# Altium schematic sheet esp.SchDoc (part 2 of 3)
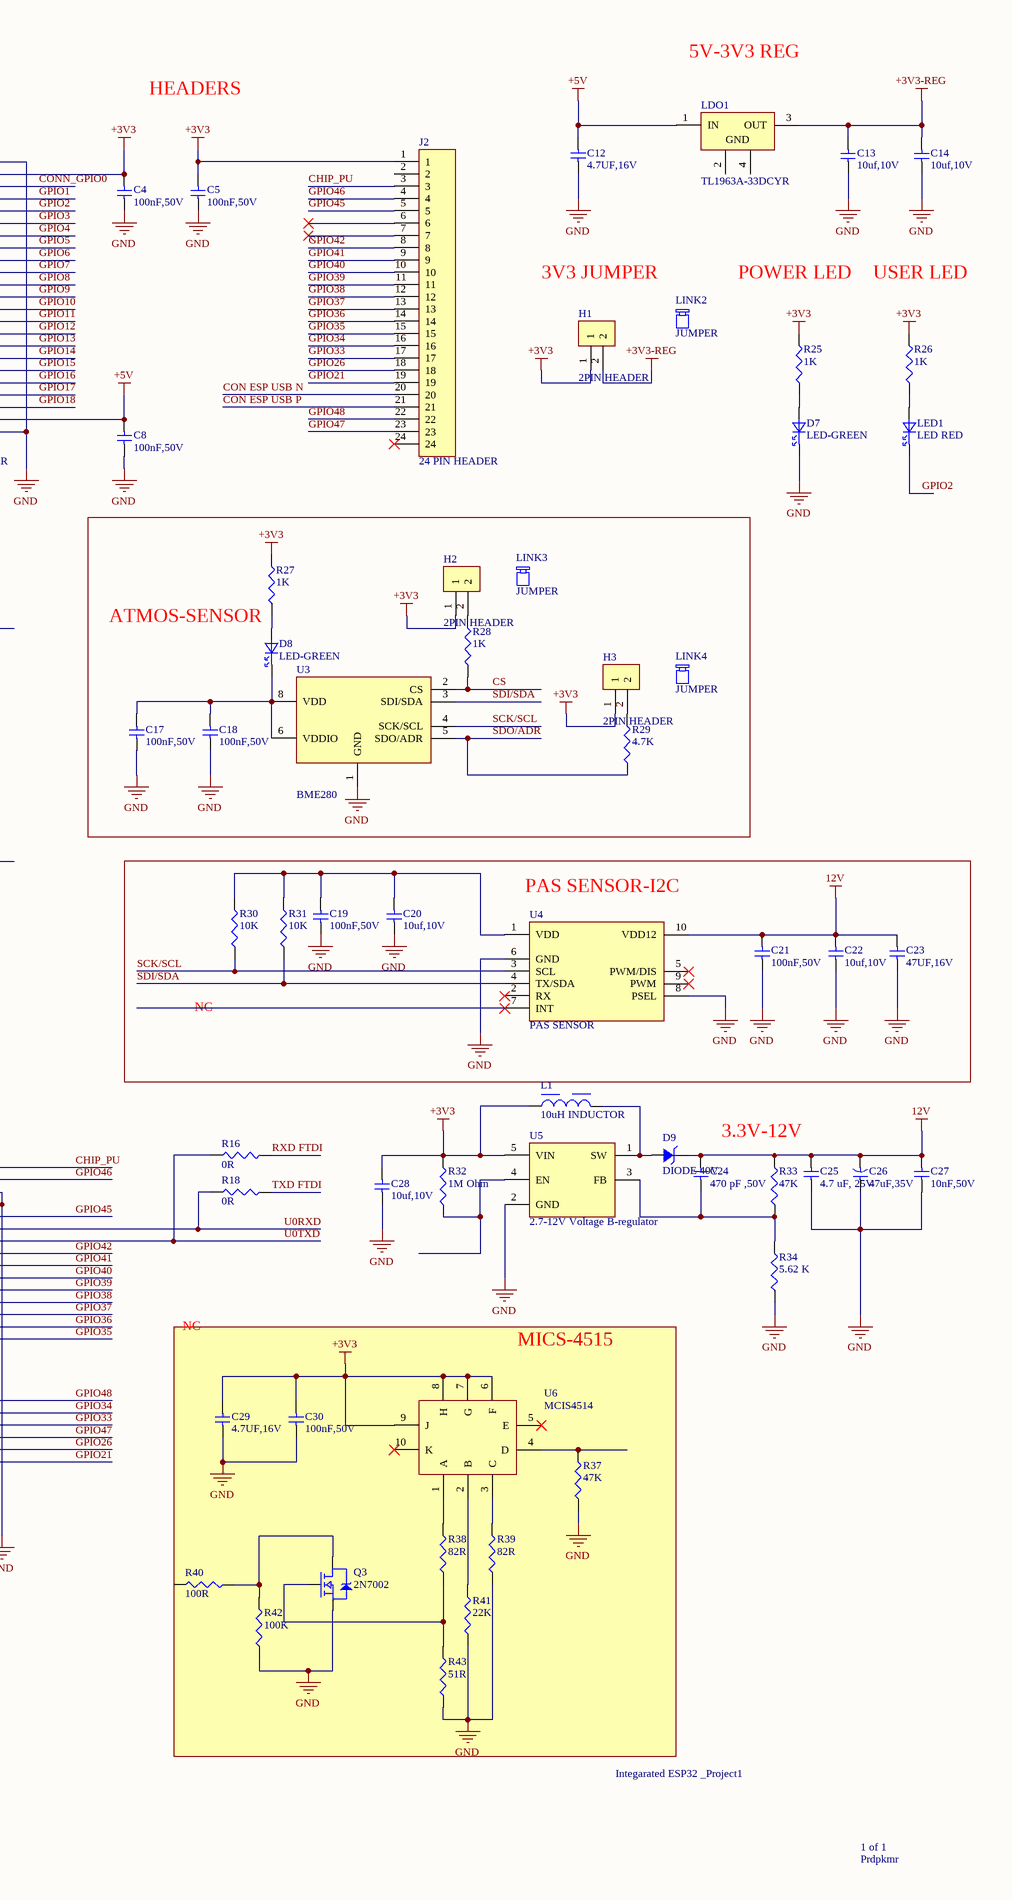
[diagram p2: esp.SchDoc, right]
## Library data of the parts
C1 C12 C29 = CL05A475KQ5NRNC: CAP CER 4.7UF 6.3V X5R 0402; Manufacturer: Samsung; Material: Ceramic; Tolerance: 10%; Supplier: Avnet; Supplier Part Number: CL05A475KQ5NRNC; Manufacturer Part Number: CL05A475KQ5NRNC; RoHS: Yes; Category: Ceramic Capacitors; Stock: 1403600; Pricing: 1=0.00646 (USD); Mounting Technology: Surface Mount; Case/Package: 0402; Case Code (Metric): 1005; Case Code (Imperial): 0402; Min Operating Temperature: -55°C; Max Operating Temperature: 85°C; Package Quantity: 1; Packaging: Tape and Reel; Value: 4.7uF; Voltage Rating: 6.3V; Dielectric: X5R; Series: CL; Construction: Flat; Length: 1mm; Width: 0.02inch; Height: 0.5mm; Thickness: 0.022inch; Depth: 0.5mm; Radiation Hardening: No; Lead Free: Lead Free; RoHS Compliant: Yes; ComponentLink1URL: https://datasheet.ciiva.com/25793/cl05a475kq5nrnc-25793634.pdf?src-supplier=Digikey; ComponentLink1Description: https://datasheet.ciiva.com/25793/cl05a475kq5nrnc-25793634.pdf?src-supplier=Digikey; ComponentLink2URL: https://datasheet.ciiva.com/26838/getdatasheetpartid-353228-26838196.pdf?src-supplier=Verical; ComponentLink2Description: https://datasheet.ciiva.com/26838/getdatasheetpartid-353228-26838196.pdf?src-supplier=Verical; LCSC PART Number: C2932473
C2-C10 C16-C19 C21 C30 = CL05B104KB54PNC: Manufacturer: Samsung; Material: 4241ConductorMaterial; Tolerance: 10%; Supplier: Avnet; Supplier Part Number: CL05B104KB54PNC; Manufacturer Part Number: CL05B104KB54PNC; RoHS: Yes; Category: Ceramic Capacitors; Pricing: 10000=0.00428, 20000=0.00423, 40000=0.00747, 60000=0.00411, 80000=0.00406 (USD); Min Operating Temperature: -55°C; Max Operating Temperature: 125°C; Value: 100nF; Voltage Rating: 50V; Height: 550um; RoHS Compliant: Yes; ComponentLink1URL: https://datasheet.octopart.com/CL05B104KB54PNC-Samsung-datasheet-8326407.pdf?src-supplier=TME; ComponentLink1Description: https://datasheet.octopart.com/CL05B104KB54PNC-Samsung-datasheet-8326407.pdf?src-supplier=TME; LCSC PART Number: C307331
C11 C13 C14 C20 C22 C28 = CL05A106MP5NRNC: Manufacturer: Samsung; Material: Ceramic; Tolerance: 20%; Supplier: Avnet; Supplier Part Number: CL05A106MP5NRNC; Manufacturer Part Number: CL05A106MP5NRNC; RoHS: Yes; Category: Ceramic Capacitors; Pricing: 100000=0.0442, 120000=0.04397, 220000=0.04375, 500000=0.04352, 1000000=0.0433 (USD); Case/Package: 0402; Min Operating Temperature: -55°C; Max Operating Temperature: 85°C; Value: 10uF; Voltage Rating: 10V; Height: 550um; RoHS Compliant: Yes; LCSC PART Number: C315248
C15 = CL05A105KL5NRNC: Manufacturer: Samsung; Material: 4241ConductorMaterial; Voltage Rating: 35V; Tolerance: 10%; Supplier: Digikey; Supplier Part Number: 1276-6796-1-ND; Manufacturer Part Number: CL05A105KL5NRNC; RoHS: Yes; Category: Ceramic Capacitors; Stock: 194971; Pricing: 1=0.27, 10=0.17, 100=0.1027, 1000=0.07807, 2500=0.06853, 5000=0.0679, 10000=0.05902, 20000=0.05548, 30000=0.05372, 50000=0.05194, 70000=0.04872, 100000=0.04608 (USD); Mounting Technology: Surface Mount; Case/Package: 0402; Case Code (Metric): 1005; Case Code (Imperial): 0402; Min Operating Temperature: -55°C; Max Operating Temperature: 85°C; Packaging: Cut Tape; Value: 1uF; Series: CL; Length: 0.039inch; Width: 0.02inch; Height: 550um; Thickness: 0.022inch; RoHS Compliant: Yes; ComponentLink1URL: http://www.samsungsem.com/kr/support/product-search/mlcc/CL05A105KL5NRNC.jsp?src-supplier=Digikey; ComponentLink1Description: http://www.samsungsem.com/kr/support/product-search/mlcc/CL05A105KL5NRNC.jsp?src-supplier=Digikey; ComponentLink2URL: https://datasheet.octopart.com/CL05A105KL5NRNC-Samsung-datasheet-8326407.pdf?src-supplier=TME; ComponentLink2Description: https://datasheet.octopart.com/CL05A105KL5NRNC-Samsung-datasheet-8326407.pdf?src-supplier=TME; LCSC PART Number: C307413
C23 = T499D476K016ATE800: CAP TANT 47UF 10% 16V 2917; Manufacturer: KEMET; Dielectric Material: Tantalum; ESR (Equivalent Series Resistance): 800mR; Polarity: Polar; Dissipation Factor: 6%; Supplier: Mouser; Supplier Part Number: 80-T499D476K16TE800; Manufacturer Part Number: T499D476K016ATE800; RoHS: Yes; Category: Tantalum Capacitors; Stock: 4898; Pricing: 1=2.24, 10=1.43, 50=1.31, 100=1.31, 1000=1.12, 10000=0.758 (USD); Mounting Technology: Surface Mount; Case/Package: 2917; Pins: 2; Case Code (Metric): 7343; Case Code (Imperial): 2917; Min Operating Temperature: -55°C; Max Operating Temperature: 175°C; Package Quantity: 1; Value: 47uF; Voltage Rating: 16V; Tolerance: 10%; Packaging: Tape and Reel; Voltage Rating (DC): 16V; Termination: SMD/SMT; Features: General Purpose; Series: T499; Construction: Flat; Length: 7.3mm; Width: 0.169inch; Height: 3.1mm; Height - Seated (Max): 0.11inch; Depth: 4.3mm; Ratings: AEC-Q200; Radiation Hardening: No; Reach SVHC Compliant: No; Lead Free: Lead Free; RoHS Compliant: Yes; ComponentLink1URL: https://datasheet.ciiva.com/261/kem-t2054-t499-auto-261119.pdf?src-supplier=Digikey; ComponentLink1Description: https://datasheet.ciiva.com/261/kem-t2054-t499-auto-261119.pdf?src-supplier=Digikey; ComponentLink2URL: https://datasheet.ciiva.com/261/kem-t2054-t499-auto-261120.pdf?src-supplier=Digikey; ComponentLink2Description: https://datasheet.ciiva.com/261/kem-t2054-t499-auto-261120.pdf?src-supplier=Digikey; ComponentLink3URL: https://datasheet.ciiva.com/261/kem-t2054-t499-auto-261121.pdf?src-supplier=Digikey; ComponentLink3Description: https://datasheet.ciiva.com/261/kem-t2054-t499-auto-261121.pdf?src-supplier=Digikey; LCSC PART Number: C122336
C24 = CC0402FRNPO9BN471: CAP CER 470PF 50V C0G/NPO 0402; Manufacturer: Yageo; Supplier: Future Electronics; Supplier Part Number: 5114427; Manufacturer Part Number: CC0402FRNPO9BN471; RoHS: Yes; Category: Ceramic Capacitors; Stock: 10000; Pricing: 10000=0.015, 20000=0.0148, 30000=0.0146, 50000=0.0145, 100000=0.0141 (USD); RoHS Compliant: Yes; ComponentLink1URL: https://datasheet.octopart.com/CC0402FRNPO9BN471-Yageo-datasheet-151948684.pdf?src-supplier=Farnell; ComponentLink1Description: https://datasheet.octopart.com/CC0402FRNPO9BN471-Yageo-datasheet-151948684.pdf?src-supplier=Farnell; ComponentLink2URL: https://datasheet.octopart.com/CC0402FRNPO9BN471-Yageo-datasheet-151948684.pdf?src-supplier=Newark; ComponentLink2Description: https://datasheet.octopart.com/CC0402FRNPO9BN471-Yageo-datasheet-151948684.pdf?src-supplier=Newark; ComponentLink3URL: https://datasheet.octopart.com/CC0402FRNPO9BN471-Yageo-datasheet-137875056.pdf?src-supplier=Future+Electronics; ComponentLink3Description: https://datasheet.octopart.com/CC0402FRNPO9BN471-Yageo-datasheet-137875056.pdf?src-supplier=Future+Electronics; LCSC PART Number: C513551
C25 = KGM05CR51E475MH: Cap Cer 4.7UF 25V X5R 0402; Manufacturer: Kyocera AVX; Supplier: Digikey; Supplier Part Number: 478-KGM05CR51E475MHCT-ND; Manufacturer Part Number: KGM05CR51E475MH; RoHS: No; Stock: 57965; Pricing: 1=0.26, 10=0.167, 100=0.1145, 1000=0.08368, 2500=0.07509, 5000=0.0696 (USD); LCSC PART Number: C20218024
C26 = T495X476M035ATE300: CAP TANT 47UF 20% 35V 2917; Manufacturer: KEMET; Dielectric Material: 5684ConductorMaterial; ESR (Equivalent Series Resistance): 300mR; Dissipation Factor: 8%; Supplier: Arrow Electronics; Supplier Part Number: T495X476M035ATE300; Manufacturer Part Number: T495X476M035ATE300; RoHS: Yes; Category: Tantalum Capacitors; Stock: 1000; Pricing: 500=1.0041, 1000=0.9091, 2000=0.8325, 5000=0.8058, 10000=0.7684 (USD); Mounting Technology: Surface Mount; Case/Package: 2917; Pins: 2; Case Code (Metric): 7343; Case Code (Imperial): 2917; Weight: 0.023634oz; Min Operating Temperature: -55°C; Max Operating Temperature: 125°C; Packaging: Tape and Reel; Value: 47uF; Voltage Rating: 35V; Tolerance: 20%; Voltage Rating (DC): 35V; Termination: SMD/SMT; Features: General Purpose; Series: T495; Construction: Flat; Length: 7.3mm; Width: 4.3mm; Height: 4.3mm; Depth: 4.3mm; Radiation Hardening: No; Reach SVHC Compliant: No; RoHS Compliant: Yes; ComponentLink1URL: https://datasheet.ciiva.com/5933/kem-t2009-t495-5933557.pdf?src-supplier=Farnell; ComponentLink1Description: https://datasheet.ciiva.com/5933/kem-t2009-t495-5933557.pdf?src-supplier=Farnell; ComponentLink2URL: https://datasheet.ciiva.com/46437/1761160-46437884.pdf?src-supplier=Element14; ComponentLink2Description: https://datasheet.ciiva.com/46437/1761160-46437884.pdf?src-supplier=Element14; ComponentLink3URL: https://datasheet.ciiva.com/7759/kem-t2009-t495-7759181.pdf?src-supplier=Element14; ComponentLink3Description: https://datasheet.ciiva.com/7759/kem-t2009-t495-7759181.pdf?src-supplier=Element14; LCSC PART Number: C4984204
C27 = C0402C103K5RECAUTO: CAP CER 0402 10NF 50V X7R 10%; Manufacturer: KEMET; Supplier: Arrow Electronics; Supplier Part Number: C0402C103K5RECAUTO; Manufacturer Part Number: C0402C103K5RECAUTO; RoHS: Yes; Category: Ceramic Capacitors; Stock: 2267; Pricing: 1=0.078, 10=0.058, 25=0.054, 100=0.0297, 250=0.0294, 500=0.0291, 1000=0.0175 (USD); Mounting Technology: Surface Mount; Case/Package: 0402; Min Operating Temperature: -55°C; Max Operating Temperature: 125°C; Packaging: Tape and Reel; Value: 10nF; Tolerance: 10%; Voltage Rating: 50V; Series: ESD SMD Auto X7R; Dielectric: X7R; Voltage Rating (DC): 50V; Ratings: AEC-Q200; RoHS Compliant: Yes; ComponentLink1URL: https://datasheet.octopart.com/C0402C103K5RECAUTO-KEMET-datasheet-149521617.pdf?src-supplier=Farnell; ComponentLink1Description: https://datasheet.octopart.com/C0402C103K5RECAUTO-KEMET-datasheet-149521617.pdf?src-supplier=Farnell; ComponentLink2URL: https://api.kemet.com/component-edge/download/datasheet/C0402C103K5RECAUTO.pdf?src-supplier=Digikey; ComponentLink2Description: https://api.kemet.com/component-edge/download/datasheet/C0402C103K5RECAUTO.pdf?src-supplier=Digikey; ComponentLink3URL: https://datasheet.octopart.com/C0402C103K5RECAUTO-KEMET-datasheet-175422754.pdf?src-supplier=Newark; ComponentLink3Description: https://datasheet.octopart.com/C0402C103K5RECAUTO-KEMET-datasheet-175422754.pdf?src-supplier=Newark; ComponentLink4URL: http://www.farnell.com/datasheets/2723677.pdf?src-supplier=Newark; ComponentLink4Description: http://www.farnell.com/datasheets/2723677.pdf?src-supplier=Newark; ComponentLink5URL: http://www.farnell.com/datasheets/2723677.pdf?src-supplier=Element14; ComponentLink5Description: http://www.farnell.com/datasheets/2723677.pdf?src-supplier=Element14; ComponentLink6URL: https://datasheet.octopart.com/C0402C103K5RECAUTO-KEMET-datasheet-153706760.pdf?src-supplier=Electro+Sonic; ComponentLink6Description: https://datasheet.octopart.com/C0402C103K5RECAUTO-KEMET-datasheet-153706760.pdf?src-supplier=Electro+Sonic; LCSC PART Number: C1513170
D1-D6 = AQ3045-01ETG: TVS DIODE 5.3VWM 12VC SOD882; Manufacturer: Littelfuse; Number of Bidirectional Channels: 1; Reverse Standoff Voltage: 5.3V; Min Breakdown Voltage: 6.8V; Peak Pulse Current: 3A; Peak Pulse Power: 40W; Power Line Protection: No; Diode Type: ZENER; Leakage Current: 100nA; Supplier: Digikey; Supplier Part Number: F9321CT-ND; Manufacturer Part Number: AQ3045-01ETG; RoHS: Yes; Category: TVS Diodes; Stock: 12123; Pricing: 1=0.46, 10=0.302, 100=0.141, 500=0.134, 1000=0.127, 2000=0.1255, 5000=0.124 (USD); Mounting Technology: Surface Mount; Min Operating Temperature: -55°C; Max Operating Temperature: 150°C; Packaging: Cut Tape; Series: Automotive, AEC-Q101, AQ3045, SPA®; Number of Channels: 1; Operating Supply Voltage: 5.3V; RoHS Compliant: Yes; ComponentLink1URL: http://www.littelfuse.com/~/media/electronics/datasheets/tvs_diode_arrays/littelfuse_tvs_diode_array_aq3045_datasheet.pdf.pdf?src-supplier=Digikey; ComponentLink1Description: http://www.littelfuse.com/~/media/electronics/datasheets/tvs_diode_arrays/littelfuse_tvs_diode_array_aq3045_datasheet.pdf.pdf?src-supplier=Digikey; ComponentLink2URL: https://www.littelfuse.com/~/media/electronics/datasheets/tvs_diode_arrays/littelfuse_tvs_diode_array_aq3045_datasheet.pdf.pdf?src-supplier=Digikey; ComponentLink2Description: https://www.littelfuse.com/~/media/electronics/datasheets/tvs_diode_arrays/littelfuse_tvs_diode_array_aq3045_datasheet.pdf.pdf?src-supplier=Digikey; ComponentLink3URL: https://datasheet.octopart.com/AQ3045-01ETG-Littelfuse-datasheet-101609968.pdf?src-supplier=Farnell; ComponentLink3Description: https://datasheet.octopart.com/AQ3045-01ETG-Littelfuse-datasheet-101609968.pdf?src-supplier=Farnell; ComponentLink4URL: https://datasheet.octopart.com/AQ3045-01ETG-Littelfuse-datasheet-140480283.pdf?src-supplier=Future+Electronics; ComponentLink4Description: https://datasheet.octopart.com/AQ3045-01ETG-Littelfuse-datasheet-140480283.pdf?src-supplier=Future+Electronics; LCSC PART Number: C3710326
D7 D8 = VLMG1500-GS08: LED YLW-GRN 0402 SMD; Manufacturer: Vishay; Color: Green,Yellow; Lens Color: Clear; Viewing Angle: 130°; Illumination Color: Green; Forward Current: 30mA; Forward Voltage: 2V; Luminous Intensity: 35mcd; Dominant Wavelength: 571nm; Test Current: 20mA; Number of Elements: 1; Power Dissipation: 75mW; Lens Style: Rectangular; Reverse Voltage: 5V; Supplier: Mouser; Supplier Part Number: 78-VLMG1500-GS08; Manufacturer Part Number: VLMG1500-GS08; RoHS: Yes; Category: LEDs; Stock: 31007; Pricing: 1=0.33, 10=0.189, 50=0.189, 100=0.089, 1000=0.08, 10000=0.055 (USD); Mounting Technology: Surface Mount; Case/Package: 0402; Pins: 2; Case Code (Metric): 1005; Case Code (Imperial): 0402; Min Operating Temperature: -30°C; Max Operating Temperature: 85°C; Package Quantity: 1; Packaging: Tape and Reel; Wavelength: 571nm; Number of LEDs: 1; Power Rating: 75mW; Series: CHipLED; Length: 1mm; Width: 0.5mm; Height: 0.35mm; Depth: 0.5mm; Radiation Hardening: No; Lead Free: Lead Free; RoHS Compliant: Yes; Reach SVHC Compliant: Unknown; ComponentLink1URL: https://datasheet.ciiva.com/13945/vlmo1500-13945360.pdf?src-supplier=Digikey; ComponentLink1Description: https://datasheet.ciiva.com/13945/vlmo1500-13945360.pdf?src-supplier=Digikey; ComponentLink2URL: https://datasheet.ciiva.com/12071/vlmo1500-244705-12071911.pdf?src-supplier=Mouser; ComponentLink2Description: https://datasheet.ciiva.com/12071/vlmo1500-244705-12071911.pdf?src-supplier=Mouser; ComponentLink3URL: https://datasheet.ciiva.com/13945/vlmo1500-13945358.pdf?src-supplier=Digikey; ComponentLink3Description: https://datasheet.ciiva.com/13945/vlmo1500-13945358.pdf?src-supplier=Digikey; ComponentLink4URL: https://datasheet.ciiva.com/13945/vlmo1500-13945359.pdf?src-supplier=Digikey; ComponentLink4Description: https://datasheet.ciiva.com/13945/vlmo1500-13945359.pdf?src-supplier=Digikey; ComponentLink5URL: https://datasheet.ciiva.com/30005/vlmo1500-30005134.pdf?src-supplier=Avnet; ComponentLink5Description: https://datasheet.ciiva.com/30005/vlmo1500-30005134.pdf?src-supplier=Avnet; LCSC PART Number: C511404
D9 = SMAJ36CA/TR13: TVS DIODE 36VWM 58.1VC DO214AC; Manufacturer: Yageo; Supplier: Digikey; Supplier Part Number: 13-SMAJ36CA/TR13CT-ND; Manufacturer Part Number: SMAJ36CA/TR13; RoHS: Yes; Stock: 6450; Pricing: 1=0.24, 10=0.153, 100=0.069, 500=0.0655, 1000=0.062 (USD); RoHS Compliant: Yes; LCSC PART Number: C87270
H1-H3 = FTS-102-01-F-S: CONN HEADER VERT 2POS 1.27MM; Manufacturer: Samtec; Number of Contacts: 2; Gender: Male; Supplier: Avnet; Supplier Part Number: FTS-102-01-F-S; Manufacturer Part Number: FTS-102-01-F-S; RoHS: Yes; Category: Connectors; Stock: 3208; Pricing: 1=0.4802, 10=0.47775, 30=0.3492, 50=0.3474, 100=0.3456 (USD); Mounting Technology: Through Hole; Contact Plating: Gold; Contact Material: Bronze; Contact Shape: Square; Contact Finish - Mating: GOLD; Insulation Material: Polymer; Insulation Color: Black; Min Operating Temperature: -55°C; Max Operating Temperature: 125°C; Number of Rows: 1; Packaging: Bulk; Termination: Solder; Fastening Type: Pull; Series: FTS; Contact Type: Male Pin; Number of Positions: 2; Pitch: 1.27mm; Radiation Hardening: No; RoHS Compliant: Yes; Flammability Rating: UL94 V-0; ComponentLink1URL: http://suddendocs.samtec.com/catalog_english/fts.pdf?src-supplier=Digikey; ComponentLink1Description: http://suddendocs.samtec.com/catalog_english/fts.pdf?src-supplier=Digikey; ComponentLink2URL: http://www.samtec.com/documents/webfiles/pdf/FTS.pdf?src-supplier=Avnet; ComponentLink2Description: http://www.samtec.com/documents/webfiles/pdf/FTS.pdf?src-supplier=Avnet; ComponentLink3URL: https://datasheet.octopart.com/FTS-102-01-F-S-Samtec-datasheet-151470456.pdf?src-supplier=Sager+Electronics; ComponentLink3Description: https://datasheet.octopart.com/FTS-102-01-F-S-Samtec-datasheet-151470456.pdf?src-supplier=Sager+Electronics; ComponentLink4URL: https://datasheet.octopart.com/FTS-102-01-F-S-Samtec-datasheet-118493358.pdf?src-supplier=Electro+Sonic; ComponentLink4Description: https://datasheet.octopart.com/FTS-102-01-F-S-Samtec-datasheet-118493358.pdf?src-supplier=Electro+Sonic; ComponentLink5URL: https://datasheet.octopart.com/FTS-102-01-F-S-Samtec-datasheet-176663378.pdf?src-supplier=Toby+Electronics; ComponentLink5Description: https://datasheet.octopart.com/FTS-102-01-F-S-Samtec-datasheet-176663378.pdf?src-supplier=Toby+Electronics; LCSC PART Number: C6045317
J1 J2 = 22-28-4245: CONN HEADER VERT 24POS 2.54MM; Manufacturer: Molex; Plating: Tin; Current Rating: 4A; Gender: Male; Number of Circuits: 24; Supplier: Mouser; Supplier Part Number: 538-22-28-4245; Manufacturer Part Number: 22-28-4245; RoHS: No; Category: Headers and Wire Housings; Stock: 182; Pricing: 1=1.21, 10=1.14, 50=1.14, 100=1.06, 1000=0.709, 10000=0.709 (USD); Mounting Technology: Through Hole; Contact Material: Brass; Contact Plating: Gold; Housing Color: Black; Number of Contacts: 24; Number of Positions: 24; Number of Rows: 1; Orientation: Vertical; Packaging: Bulk; Termination: Solder; Pitch: 2.54mm; Lead Free: Lead Free; ComponentLink1URL: https://datasheet.ciiva.com/6814/022284363-sd-6814049.pdf?src-supplier=Digikey; ComponentLink1Description: https://datasheet.ciiva.com/6814/022284363-sd-6814049.pdf?src-supplier=Digikey; ComponentLink2URL: https://datasheet.ciiva.com/10075/0022284245-pcb-headers-10075617.pdf?src-supplier=Avnet; ComponentLink2Description: https://datasheet.ciiva.com/10075/0022284245-pcb-headers-10075617.pdf?src-supplier=Avnet; ComponentLink3URL: https://datasheet.ciiva.com/1433/1597854-1433759.pdf?src-supplier=Element14; ComponentLink3Description: https://datasheet.ciiva.com/1433/1597854-1433759.pdf?src-supplier=Element14; LCSC PART Number: C7145888
J3 J4 = 217179-0001: CONN RCP USB2.0 TYP C 24P SMD RA; Manufacturer: Molex; Current Rating: 1.25A; Gender: Receptacle; Number of Contacts: 16; Voltage Rating: 30V; Supplier: Mouser; Supplier Part Number: 538-217179-0001; Manufacturer Part Number: 217179-0001; RoHS: No; Category: Connectors; Stock: 26428; Pricing: 1=0.79, 10=0.56, 50=0.56, 100=0.513, 1000=0.513, 1200=0.436, 2400=0.41, 4800=0.399, 10000=0.399, 24000=0.39 (USD); Contact Material: Nickel,Gold; Min Operating Temperature: -40°C; Max Operating Temperature: 85°C; USB Standard: USB 2.0; Height: 3.36mm; LCSC PART Number: C3197684
J5 = FTS-103-01-F-S: CONN HEADER VERT 3POS 1.27MM; Manufacturer: Samtec; Number of Contacts: 3; Gender: Male; Supplier: Digikey; Supplier Part Number: 612-FTS-103-01-F-S-ND; Manufacturer Part Number: FTS-103-01-F-S; RoHS: Yes; Category: Connectors; Stock: 1896; Pricing: 1=0.73, 50=0.6378, 100=0.5407, 500=0.4491, 1000=0.38362, 2000=0.31431, 5000=0.2478, 10000=0.228 (USD); Mounting Technology: Through Hole; Contact Plating: Gold; Number of Rows: 1; Packaging: Bulk; Termination: Solder; Pitch: 1.27mm; Radiation Hardening: No; RoHS Compliant: Yes; ComponentLink1URL: http://suddendocs.samtec.com/prints/fts-1xx-xx-xx-xx-xx-mkt.pdf?src-supplier=Digikey; ComponentLink1Description: http://suddendocs.samtec.com/prints/fts-1xx-xx-xx-xx-xx-mkt.pdf?src-supplier=Digikey; ComponentLink2URL: http://www.samtec.com/documents/webfiles/pdf/FTS.pdf?src-supplier=Avnet; ComponentLink2Description: http://www.samtec.com/documents/webfiles/pdf/FTS.pdf?src-supplier=Avnet; ComponentLink3URL: https://datasheet.octopart.com/FTS-103-01-F-S-Samtec-datasheet-176663378.pdf?src-supplier=Toby+Electronics; ComponentLink3Description: https://datasheet.octopart.com/FTS-103-01-F-S-Samtec-datasheet-176663378.pdf?src-supplier=Toby+Electronics; ComponentLink4URL: https://datasheet.octopart.com/FTS-103-01-F-S-Samtec-datasheet-151470456.pdf?src-supplier=Sager+Electronics; ComponentLink4Description: https://datasheet.octopart.com/FTS-103-01-F-S-Samtec-datasheet-151470456.pdf?src-supplier=Sager+Electronics; LCSC PART Number: C3333578
L1 = 74404020100: FIXED IND 10UH 500MA 850MOHM SMD; Manufacturer: Wurth Electronics; Core Material: Ferrite; Tolerance: 20%; Saturation Current: 600mA; Shielding: Shielded; DC Resistance (DCR): 850mR; Self Resonant Frequency: 39MHz; Test Frequency: 1MHz; Würth Elektronik: 73D1808; Supplier: Digikey; Supplier Part Number: 732-10745-1-ND; Manufacturer Part Number: 74404020100; RoHS: Yes; Category: Fixed Inductors; Stock: 3411; Pricing: 1=0.54, 50=0.451, 100=0.3429, 1000=0.2979 (USD); Mounting Technology: Surface Mount; Case/Package: Nonstandard; Min Operating Temperature: -40°C; Max Operating Temperature: 125°C; Packaging: Cut Tape; Value: 10uH; Current Rating: 500mA; Series: WE-LQS; Inductance Tolerance: 20%; Length: 2mm; Width: 1.6mm; Height: 1mm; RoHS Compliant: Yes; ComponentLink1URL: http://www.farnell.com/datasheets/2277209.pdf?src-supplier=Farnell; ComponentLink1Description: http://www.farnell.com/datasheets/2277209.pdf?src-supplier=Farnell; ComponentLink2URL: http://www.farnell.com/datasheets/2277209.pdf?src-supplier=Element14; ComponentLink2Description: http://www.farnell.com/datasheets/2277209.pdf?src-supplier=Element14; ComponentLink3URL: https://katalog.we-online.de/pbs/datasheet/74404020100.pdf?src-supplier=Digikey; ComponentLink3Description: https://katalog.we-online.de/pbs/datasheet/74404020100.pdf?src-supplier=Digikey; ComponentLink4URL: http://www.farnell.com/datasheets/2277209.pdf?src-supplier=Newark; ComponentLink4Description: http://www.farnell.com/datasheets/2277209.pdf?src-supplier=Newark
LDO1 = TL1963A-33DCYR: IC REG LIN 3.3V 1.5A SOT-223-4; Manufacturer: Texas Instruments; Number of Outputs: 1; Dropout Voltage: 340mV; Max Supply Voltage: 20V; Min Input Voltage: 2.1V; Input Bias Current: 1mA; Polarity: Positive; Accuracy: 3%; Output Type: Fixed; Supplier: Mouser; Supplier Part Number: 595-TL1963A-33DCYR; Manufacturer Part Number: TL1963A-33DCYR; RoHS: Yes; Category: Voltage Regulators - Linear; Stock: 9346; Pricing: 1=2.77, 10=2.07, 50=1.9, 100=1.7, 1000=1.51, 10000=1.39 (USD); Case/Package: SOT-223-4; Pins: 4; Weight: 0.003951oz; Min Operating Temperature: -40°C; Max Operating Temperature: 125°C; Packaging: Cut Tape; Output Voltage: 3.3V; Output Current: 1.5A; Package Quantity: 2500; Max Output current: 1.5A; Min Output Voltage: 3.3V; Quiescent Current: 1mA; Max Output Voltage: 3.3V; Operating Supply Current: 1mA; Series: TL1963A-33; Length: 6.5mm; Width: 3.5mm; Height: 1.6mm; Thickness: 1.6mm; Lead Free: Lead Free; RoHS Compliant: Yes; ComponentLink1URL: https://datasheet.ciiva.com/2046/-2046068.pdf?src-supplier=Digikey; ComponentLink1Description: https://datasheet.ciiva.com/2046/-2046068.pdf?src-supplier=Digikey; LCSC PART Number: C181262
LED1 = VLMS1500-GS08: LED RED 0402 SMD; Manufacturer: Vishay; Viewing Angle: 130°; Forward Current: 30mA; Forward Voltage: 2V; Luminous Intensity: 54mcd; Dominant Wavelength: 631nm; Test Current: 20mA; Lens Style: Flat,Rectangular,Square; Number of LEDs: 1; Power Rating: 75mW; Lens Size: 0.5mm; Supplier: Mouser; Supplier Part Number: 78-VLMS1500-GS08; Manufacturer Part Number: VLMS1500-GS08; RoHS: Yes; Category: LEDs; Stock: 5861; Pricing: 1=0.33, 10=0.189, 50=0.189, 100=0.089, 1000=0.076, 10000=0.056 (USD); Mounting Technology: Surface Mount; Case/Package: 0402; Pins: 2; Color: Red; Case Code (Metric): 1005; Case Code (Imperial): 0402; Min Operating Temperature: -30°C; Max Operating Temperature: 85°C; Package Quantity: 9000; Packaging: Tape and Reel; Illumination Color: Red; Wavelength: 631nm; Series: CHipLED; Length: 1mm; Width: 0.5mm; Height: 0.55mm; Radiation Hardening: No; Lead Free: Lead Free; RoHS Compliant: Yes; Reach SVHC Compliant: Unknown; ComponentLink1URL: https://datasheet.ciiva.com/13945/vlmo1500-13945367.pdf?src-supplier=Digikey; ComponentLink1Description: https://datasheet.ciiva.com/13945/vlmo1500-13945367.pdf?src-supplier=Digikey; ComponentLink2URL: https://datasheet.ciiva.com/13945/vlmo1500-13945368.pdf?src-supplier=Digikey; ComponentLink2Description: https://datasheet.ciiva.com/13945/vlmo1500-13945368.pdf?src-supplier=Digikey; ComponentLink3URL: https://datasheet.ciiva.com/13945/vlmo1500-13945369.pdf?src-supplier=Digikey; ComponentLink3Description: https://datasheet.ciiva.com/13945/vlmo1500-13945369.pdf?src-supplier=Digikey; LCSC PART Number: C511370
LINK1-LINK4 = M50-1920005: CONN SHUNT 1.27MM RED; Manufacturer: Harwin; Current Rating: 1A; Voltage Rating: 500V; Insulation Resistance: 1R; Number of Positions: 2; Supplier: Digikey; Supplier Part Number: 952-1727-ND; Manufacturer Part Number: M50-1920005; RoHS: Yes; Category: Headers and Wire Housings; Stock: 2193; Pricing: 1=0.33, 10=0.284, 25=0.2664, 50=0.2536, 100=0.2414, 250=0.22628, 500=0.21546, 1000=0.20516, 3000=0.18984 (USD); Color: Red; Contact Material: Copper Alloy; Contact Plating: Gold; Housing Material: PBT; Min Operating Temperature: -40°C; Max Operating Temperature: 105°C; Package Quantity: 1000; Packaging: Bulk; Series: Archer M50; Pitch: 1.27mm; Reach SVHC Compliant: No; Flammability Rating: UL94 V-0; RoHS Compliant: Yes; ComponentLink1URL: https://datasheet.ciiva.com/4573/m50-19x-350826-4573042.pdf?src-supplier=Mouser; ComponentLink1Description: https://datasheet.ciiva.com/4573/m50-19x-350826-4573042.pdf?src-supplier=Mouser; ComponentLink2URL: https://datasheet.ciiva.com/767/m50-19x-767921.pdf?src-supplier=Digikey; ComponentLink2Description: https://datasheet.ciiva.com/767/m50-19x-767921.pdf?src-supplier=Digikey; ComponentLink3URL: https://datasheet.ciiva.com/1456/m50-19x-1456640.pdf?src-supplier=Newark; ComponentLink3Description: https://datasheet.ciiva.com/1456/m50-19x-1456640.pdf?src-supplier=Newark; ComponentLink4URL: https://datasheet.ciiva.com/1412/1836978-1412125.pdf?src-supplier=Element14; ComponentLink4Description: https://datasheet.ciiva.com/1412/1836978-1412125.pdf?src-supplier=Element14; LCSC PART Number: C6985646
Q1 Q2 = SS8050-G: TRANS NPN 25V 1.5A SOT-23-3; Manufacturer: Comchip; Max Power Dissipation: 300mW; Transition Frequency: 100MHz; Collector-emitter Voltage-Max: 400mV; Collector Base Voltage (VCBO): 40V; Collector Emitter Saturation Voltage: 500mV; Emitter Base Voltage (VEBO): 5V; hFE Min: 200; Number of Elements: 1; Supplier: Digikey; Supplier Part Number: 641-1790-1-ND; Manufacturer Part Number: SS8050-G; RoHS: Yes; Category: Transistors; Stock: 149582; Pricing: 1=0.24, 10=0.148, 100=0.0921, 500=0.06754, 1000=0.05958, 3000=0.04941, 6000=0.04428, 9000=0.04166, 15000=0.03872, 21000=0.03697, 30000=0.03527, 75000=0.03155, 150000=0.02924, 300000=0.0275 (USD); Mounting Technology: Surface Mount; Case/Package: TO-236-3; Max Operating Temperature: 150°C; Packaging: Cut Tape; Max Collector Current: 1.5A; Collector Emitter Breakdown Voltage: 25V; Max Breakdown Voltage: 25V; Series: -; Power Dissipation: 300mW; Height: 1.15mm; RoHS Compliant: Yes; ComponentLink1URL: http://www.comchiptech.com/admin/files/product/SS8050-G RevA181526.pdf?src-supplier=Digikey; ComponentLink1Description: http://www.comchiptech.com/admin/files/product/SS8050-G RevA181526.pdf?src-supplier=Digikey; LCSC PART Number: C164886
Q3 = 2N7002: MOSFET SOT23 N 60V 5OHM 150C; Manufacturer: ON Semiconductor / Fairchild; Nominal Vgs: 2.1V; Input Capacitance: 50pF; Max Power Dissipation: 200mW; Rds On Max: 7.5R; Continuous Drain Current (ID): 115mA; On-State Resistance: 5.3R; Gate to Source Voltage (Vgs): 20V; Number of Channels: 1; Turn-Off Delay Time: 20ns; Supplier: Arrow Electronics; Supplier Part Number: 2N7002; Manufacturer Part Number: 2N7002; RoHS: Yes; Category: MOSFETs; Stock: 3060000; Pricing: 3000=0.104, 9000=0.0951, 24000=0.0698, 45000=0.0675, 99000=0.0359 (USD); Mounting Technology: Surface Mount; Case/Package: SOT-23; Pins: 3; Min Operating Temperature: -55°C; Max Operating Temperature: 150°C; Packaging: Tape and Reel; Package Quantity: 1; Dual Supply Voltage: 60V; Drain to Source Voltage (Vdss): 60V; Threshold Voltage: 2.1V; Voltage Rating (DC): 60V; Current Rating: 115mA; Current: 115mA; Voltage: 60V; Series: -; Drain-source On Resistance-Max: 7.5R; Turn-On Delay Time: 20ns; Length: 2.92mm; Width: 1.3mm; Height: 0.93mm; Reach SVHC Compliant: No; Lead Free: Lead Free; RoHS Compliant: Yes; ComponentLink1URL: https://datasheet.ciiva.com/931/2n7000-931762.pdf?src-supplier=Digikey; ComponentLink1Description: https://datasheet.ciiva.com/931/2n7000-931762.pdf?src-supplier=Digikey; ComponentLink2URL: https://datasheet.ciiva.com/931/2n7000-931764.pdf?src-supplier=Digikey; ComponentLink2Description: https://datasheet.ciiva.com/931/2n7000-931764.pdf?src-supplier=Digikey; ComponentLink3URL: https://datasheet.ciiva.com/1188/660093-1188359.pdf?src-supplier=Element14; ComponentLink3Description: https://datasheet.ciiva.com/1188/660093-1188359.pdf?src-supplier=Element14; ComponentLink4URL: https://datasheet.ciiva.com/1188/660093-1188361.pdf?src-supplier=Element14; ComponentLink4Description: https://datasheet.ciiva.com/1188/660093-1188361.pdf?src-supplier=Element14; ComponentLink5URL: https://datasheet.ciiva.com/22655/660093-22655230.pdf?src-supplier=Element14; ComponentLink5Description: https://datasheet.ciiva.com/22655/660093-22655230.pdf?src-supplier=Element14; ComponentLink6URL: https://datasheet.ciiva.com/1254/660093-1254452.pdf?src-supplier=Newark; ComponentLink6Description: https://datasheet.ciiva.com/1254/660093-1254452.pdf?src-supplier=Newark; ComponentLink7URL: https://datasheet.ciiva.com/17007/2n7002-17007243.pdf?src-supplier=Future+Electronics; ComponentLink7Description: https://datasheet.ciiva.com/17007/2n7002-17007243.pdf?src-supplier=Future+Electronics; LCSC PART Number: C22446827
R1-R3 R6 R16 R18 R21-R24 R35 R36 = RC0402JR-070RL: RES 0 OHM JUMPER 1/16W 0402; Manufacturer: Yageo; Value: 0mR; Power Rating: 62.5mW; Tolerance: 5%; Voltage Rating: 50V; Max Power Dissipation: 63mW; Temperature Coefficient: 200ppm/°C; Supplier: Digikey; Supplier Part Number: 311-0.0JRCT-ND; Manufacturer Part Number: RC0402JR-070RL; RoHS: Yes; Category: Chip SMD Resistors; Stock: 10747354; Pricing: 1=0.1, 10=0.01, 25=0.0064, 50=0.0054, 100=0.0047, 250=0.00392, 500=0.00346, 1000=0.00304, 5000=0.0023, 10000=0.00206, 20000=0.00185, 30000=0.00175, 50000=0.00163, 70000=0.00155, 100000=0.00148, 250000=0.00133, 500000=0.00123, 1000000=0.00115 (USD); Case/Package: 0402; Case Code (Metric): 1005; Case Code (Imperial): 0402; Contact Plating: Tin,Matte; Min Operating Temperature: -55°C; Max Operating Temperature: 155°C; Package Quantity: 1; Packaging: Tape and Reel; Resistor Type: Thick Film; Number of Terminations: 2; Termination: SMD/SMT; Features: Moisture Resistant; Series: RC; Technology: THICK FILM; Resistance Tolerance: 5%; Construction: Rectangular; Length: 1mm; Width: 0.02inch; Height: 0.016inch; Depth: 0.5mm; Military Standard: Not; Lead Free: Lead Free; RoHS Compliant: Yes; Reach SVHC Compliant: Unknown; ComponentLink1URL: https://datasheet.ciiva.com/2452/pyu-rc0402-51-rohs-l-6-2452608.pdf?src-supplier=Digikey; ComponentLink1Description: https://datasheet.ciiva.com/2452/pyu-rc0402-51-rohs-l-6-2452608.pdf?src-supplier=Digikey; ComponentLink2URL: https://datasheet.ciiva.com/11808/0900766b80c66297-11808195.pdf?src-supplier=Rs; ComponentLink2Description: https://datasheet.ciiva.com/11808/0900766b80c66297-11808195.pdf?src-supplier=Rs; ComponentLink3URL: https://datasheet.ciiva.com/2452/pyu-r-int-thick-7-2452609.pdf?src-supplier=Digikey; ComponentLink3Description: https://datasheet.ciiva.com/2452/pyu-r-int-thick-7-2452609.pdf?src-supplier=Digikey; ComponentLink4URL: https://datasheet.ciiva.com/2452/pyu-r-int-thick-7-2452610.pdf?src-supplier=Digikey; ComponentLink4Description: https://datasheet.ciiva.com/2452/pyu-r-int-thick-7-2452610.pdf?src-supplier=Digikey; ComponentLink5URL: https://datasheet.ciiva.com/8896/pyu-rc0402-51-rohs-l-6-8896201.pdf?src-supplier=Avnet; ComponentLink5Description: https://datasheet.ciiva.com/8896/pyu-rc0402-51-rohs-l-6-8896201.pdf?src-supplier=Avnet; ComponentLink6URL: https://datasheet.ciiva.com/15189/getdatasheetpartid-326379-15189533.pdf?src-supplier=Verical; ComponentLink6Description: https://datasheet.ciiva.com/15189/getdatasheetpartid-326379-15189533.pdf?src-supplier=Verical; ComponentLink7URL: https://datasheet.ciiva.com/7983/1018594-7983535.pdf?src-supplier=Element14; ComponentLink7Description: https://datasheet.ciiva.com/7983/1018594-7983535.pdf?src-supplier=Element14; ComponentLink8URL: https://datasheet.ciiva.com/22747/1018594-22747515.pdf?src-supplier=Element14; ComponentLink8Description: https://datasheet.ciiva.com/22747/1018594-22747515.pdf?src-supplier=Element14; LCSC PART Number: C60485
R4 R5 R17 R19 = RC0402FR-0727RL: RES 27 OHM 1% 1/16W 0402; Manufacturer: Yageo; Power Rating: 62.5mW; Voltage Rating: 50V; Temperature Coefficient: 100ppm/°C; Max Power Dissipation: 63mW; Supplier: Future Electronics; Supplier Part Number: 2577120; Manufacturer Part Number: RC0402FR-0727RL; RoHS: Yes; Category: Chip SMD Resistors; Stock: 2130000; Pricing: 10000=0.0007, 50000=0.0007, 200000=0.0007, 500000=0.0007, 1250000=0.0006 (USD); Case/Package: 0402; Case Code (Imperial): 0402; Case Code (Metric): 1005; Weight: 2.3E-05oz; Min Operating Temperature: -55°C; Max Operating Temperature: 155°C; Value: 27R; Tolerance: 1%; Packaging: Tape and Reel; Resistor Type: Thick Film; Termination: SMD/SMT; Number of Terminations: 2; Features: Moisture Resistant; Series: RC; Construction: Rectangular; Technology: THICK FILM; Resistance Tolerance: 1%; Voltage Rating (AC): 50V; Length: 1mm; Width: 0.5mm; Height: 0.016inch; Depth: 0.5mm; Military Standard: Not; Lead Free: Lead Free; RoHS Compliant: Yes; Reach SVHC Compliant: Unknown; ComponentLink1URL: https://datasheet.ciiva.com/11808/0900766b80c66297-11808450.pdf?src-supplier=Rs; ComponentLink1Description: https://datasheet.ciiva.com/11808/0900766b80c66297-11808450.pdf?src-supplier=Rs; ComponentLink2URL: https://datasheet.ciiva.com/17044/pyu-rc0402-51-rohs-l-6-17044345.pdf?src-supplier=Future+Electronics; ComponentLink2Description: https://datasheet.ciiva.com/17044/pyu-rc0402-51-rohs-l-6-17044345.pdf?src-supplier=Future+Electronics; ComponentLink3URL: https://datasheet.ciiva.com/15189/getdatasheetpartid-327852-15189402.pdf?src-supplier=Verical; ComponentLink3Description: https://datasheet.ciiva.com/15189/getdatasheetpartid-327852-15189402.pdf?src-supplier=Verical; ComponentLink4URL: https://datasheet.ciiva.com/7849/1018594-7849926.pdf?src-supplier=Element14; ComponentLink4Description: https://datasheet.ciiva.com/7849/1018594-7849926.pdf?src-supplier=Element14; ComponentLink5URL: https://datasheet.ciiva.com/7849/1018594-7849927.pdf?src-supplier=Element14; ComponentLink5Description: https://datasheet.ciiva.com/7849/1018594-7849927.pdf?src-supplier=Element14; LCSC PART Number: C138021
R7 R11 R14 R15 R20 R30 R31 = AC0402FR-0710KL: Manufacturer: Yageo; Value: 10kR; Tolerance: 1%; Power Rating: 62.5mW; Voltage Rating: 50V; Temperature Coefficient: 100ppm/°C; Max Power Dissipation: 63mW; Supplier: Future Electronics; Supplier Part Number: 2025338; Manufacturer Part Number: AC0402FR-0710KL; RoHS: Yes; Category: Chip SMD Resistors; Stock: 16805000; Pricing: 10000=0.0011, 40000=0.0011, 150000=0.001, 400000=0.001, 1000000=0.001 (USD); Case/Package: 0402; Case Code (Imperial): 0402; Case Code (Metric): 1005; Min Operating Temperature: -55°C; Max Operating Temperature: 155°C; Packaging: Tape and Reel; Termination: SMD/SMT; Number of Terminations: 2; Features: Moisture Resistant,Automotive AEC-Q200; Series: AC; Length: 0.039inch; Width: 0.02inch; Height: 0.015inch; Lead Free: Lead Free; RoHS Compliant: Yes; ComponentLink1URL: https://datasheet.ciiva.com/12656/pyu-ac-51-rohs-l-2-12656634.pdf?src-supplier=Mouser; ComponentLink1Description: https://datasheet.ciiva.com/12656/pyu-ac-51-rohs-l-2-12656634.pdf?src-supplier=Mouser; LCSC PART Number: C144807
R8 R9 R12 R13 = AC0402FR-075K1L: RES SMD 5.1K OHM 1% 1/16W 0402; Manufacturer: Yageo; Value: 5.1kR; Power Rating: 63mW; Temperature Coefficient: 100ppm/°C; Voltage Rating: 50V; Supplier: Digikey; Supplier Part Number: YAG3503CT-ND; Manufacturer Part Number: AC0402FR-075K1L; RoHS: Yes; Category: Chip SMD Resistors; Stock: 32155; Pricing: 1=0.1, 10=0.009, 100=0.0071, 1000=0.00612, 2500=0.0051, 5000=0.00407, 10000=0.00204 (USD); Mounting Technology: Surface Mount; Case/Package: 0402; Case Code (Metric): 1005; Case Code (Imperial): 0402; Min Operating Temperature: -55°C; Max Operating Temperature: 155°C; Tolerance: 1%; Packaging: Cut Tape; Number of Terminations: 2; Max Power Dissipation: 63mW; Features: Moisture Resistant,Automotive AEC-Q200; Series: AC; Length: 0.039inch; Width: 0.02inch; Height: 0.015inch; Lead Free: Lead Free; RoHS Compliant: Yes; ComponentLink1URL: http://www.yageo.com/NewPortal/yageodocoutput?fileName=/pdf/R-Chip/PYu-AC_51_RoHS_L_6.pdf&src-supplier=Digikey; ComponentLink1Description: http://www.yageo.com/NewPortal/yageodocoutput?fileName=/pdf/R-Chip/PYu-AC_51_RoHS_L_6.pdf&src-supplier=Digikey; ComponentLink2URL: http://www.yageo.com/documents/recent/PYu-AC_51_RoHS_L_2_revised.pdf?src-supplier=Future+Electronics; ComponentLink2Description: http://www.yageo.com/documents/recent/PYu-AC_51_RoHS_L_2_revised.pdf?src-supplier=Future+Electronics; ComponentLink3URL: https://datasheet.octopart.com/AC0402FR-075K1L-Yageo-datasheet-166720450.pdf?src-supplier=Future+Electronics; ComponentLink3Description: https://datasheet.octopart.com/AC0402FR-075K1L-Yageo-datasheet-166720450.pdf?src-supplier=Future+Electronics; LCSC PART Number: C144745
R10 R29 = RC0402FR-074K7L: RES 4.7K OHM 1% 1/16W 0402; Manufacturer: Yageo; Voltage Rating (DC): 50V; Power Rating: 62.5mW; Value: 4.7kR; Temperature Coefficient: 100ppm/°C; Max Power Dissipation: 63mW; Supplier: Future Electronics; Supplier Part Number: 3795218; Manufacturer Part Number: RC0402FR-074K7L; RoHS: Yes; Category: Chip SMD Resistors; Stock: 3880000; Pricing: 10000=0.0007, 50000=0.0007, 200000=0.0007, 500000=0.0007, 1250000=0.0006 (USD); Case/Package: 0402; Pins: 2; Case Code (Imperial): 0402; Case Code (Metric): 1005; Min Operating Temperature: -55°C; Max Operating Temperature: 155°C; Tolerance: 1%; Voltage Rating: 50V; Packaging: Tape and Reel; Resistor Type: Thick Film; Termination: SMD/SMT; Features: Moisture Resistant; Series: RC; Number of Terminations: 2; Resistance Tolerance: 1%; Construction: Rectangular; Voltage Rating (AC): 50V; Length: 1mm; Width: 0.5mm; Depth: 0.5mm; Reach SVHC Compliant: No; Military Standard: Not; Lead Free: Lead Free; RoHS Compliant: Yes; ComponentLink1URL: https://datasheet.ciiva.com/7850/1018594-7850022.pdf?src-supplier=Element14; ComponentLink1Description: https://datasheet.ciiva.com/7850/1018594-7850022.pdf?src-supplier=Element14; ComponentLink2URL: https://datasheet.ciiva.com/7850/1018594-7850023.pdf?src-supplier=Element14; ComponentLink2Description: https://datasheet.ciiva.com/7850/1018594-7850023.pdf?src-supplier=Element14; ComponentLink3URL: https://datasheet.ciiva.com/22661/1686128-22661342.pdf?src-supplier=Element14; ComponentLink3Description: https://datasheet.ciiva.com/22661/1686128-22661342.pdf?src-supplier=Element14; LCSC PART Number: C105871
R25-R28 = RT0402BRD071KL: RES SMD 1K OHM 0.1% 1/16W 0402; Manufacturer: Yageo; Value: 1kR; Power Rating: 62.5mW; Voltage Rating: 50V; Max Power Dissipation: 63mW; Temperature Coefficient: 25ppm/°C; Supplier: Future Electronics; Supplier Part Number: 4395265; Manufacturer Part Number: RT0402BRD071KL; RoHS: Yes; Category: Chip SMD Resistors; Stock: 90000; Pricing: 10000=0.0199, 20000=0.0196, 30000=0.0194, 40000=0.0193, 50000=0.0189 (USD); Case/Package: 0402; Case Code (Imperial): 0402; Case Code (Metric): 1005; Weight: 2.3E-05oz; Min Operating Temperature: -55°C; Max Operating Temperature: 155°C; Packaging: Tape and Reel; Tolerance: 0.1%; Package Quantity: 10000; Number of Terminations: 2; Termination: SMD/SMT; Voltage Rating (DC): 50V; Features: Moisture Resistant; Series: RT; Length: 0.039inch; Width: 0.5mm; Height: 0.014inch; Lead Free: Lead Free; RoHS Compliant: Yes; ComponentLink1URL: https://datasheet.ciiva.com/46635/pyu-rt-1-to-0-05-rohs-l-5-46635179.pdf?src-supplier=Digikey; ComponentLink1Description: https://datasheet.ciiva.com/46635/pyu-rt-1-to-0-05-rohs-l-5-46635179.pdf?src-supplier=Digikey; ComponentLink2URL: https://datasheet.ciiva.com/2582/pyu-rt-1-to-0-05-rohs-l-4-2582219.pdf?src-supplier=Digikey; ComponentLink2Description: https://datasheet.ciiva.com/2582/pyu-rt-1-to-0-05-rohs-l-4-2582219.pdf?src-supplier=Digikey; ComponentLink3URL: https://datasheet.ciiva.com/12837/pyu-rt-1-to-0-05-rohs-l-4-12837237.pdf?src-supplier=Mouser; ComponentLink3Description: https://datasheet.ciiva.com/12837/pyu-rt-1-to-0-05-rohs-l-4-12837237.pdf?src-supplier=Mouser; LCSC PART Number: C852624
R32 = RC0402BR-071ML: Thick Film Resistors 1 MOhms 1/16W 0402 0.1%; Manufacturer: Yageo; Value: 1MR; Parameter 1: C5842802; Supplier: Digikey; Supplier Part Number: 13-RC0402BR-071MLCT-ND; Manufacturer Part Number: RC0402BR-071ML; RoHS: Yes; Category: Chip SMD Resistors; Stock: 9912; Pricing: 1=0.35, 10=0.138, 100=0.1081, 1000=0.07038, 2500=0.06936, 5000=0.05508 (USD); Case/Package: 0402; Packaging: Tape and Reel; RoHS Compliant: Yes; ComponentLink1URL: https://datasheet.octopart.com/RC0402BR-071ML-Yageo-datasheet-164759695.pdf?src-supplier=Future+Electronics; ComponentLink1Description: https://datasheet.octopart.com/RC0402BR-071ML-Yageo-datasheet-164759695.pdf?src-supplier=Future+Electronics
R33 R37 = RT0402BRD0747KL: RES SMD 47K OHM 0.1% 1/16W 0402; Manufacturer: Yageo; Value: 47kR; Power Rating: 62.5mW; Voltage Rating: 50V; Temperature Coefficient: 25ppm/°C; Max Power Dissipation: 63mW; Supplier: Future Electronics; Supplier Part Number: 4102491; Manufacturer Part Number: RT0402BRD0747KL; RoHS: Yes; Category: Chip SMD Resistors; Stock: 10000; Pricing: 10000=0.0197, 20000=0.0194, 30000=0.0192, 40000=0.0191, 50000=0.0187 (USD); Case/Package: 0402; Case Code (Imperial): 0402; Case Code (Metric): 1005; Weight: 2.3E-05oz; Contact Plating: Tin,Lead; Min Operating Temperature: -55°C; Max Operating Temperature: 155°C; Tolerance: 0.1%; Packaging: Tape and Reel; Termination: SMD/SMT; Number of Terminations: 2; Voltage Rating (DC): 50V; Features: Moisture Resistant; Series: RT; Length: 0.039inch; Width: 0.5mm; Height: 0.014inch; Lead Free: Lead Free; RoHS Compliant: Yes; ComponentLink1URL: https://datasheet.ciiva.com/12798/pyu-rt-1-to-0-05-rohs-l-4-12798280.pdf?src-supplier=Mouser; ComponentLink1Description: https://datasheet.ciiva.com/12798/pyu-rt-1-to-0-05-rohs-l-4-12798280.pdf?src-supplier=Mouser; LCSC PART Number: C728561
R34 = RC0402FR-075K62L: RES 5.62K OHM 1% 1/16W 0402; Manufacturer: Yageo; Value: 5.62kR; Power Rating: 62.5mW; Voltage Rating: 50V; Temperature Coefficient: 100ppm/°C; Max Power Dissipation: 63mW; Supplier: Future Electronics; Supplier Part Number: 7854490; Manufacturer Part Number: RC0402FR-075K62L; RoHS: Yes; Category: Chip SMD Resistors; Stock: 1800000; Pricing: 10000=0.0007, 50000=0.0007, 200000=0.0006, 500000=0.0006, 1250000=0.0006 (USD); Case/Package: 0402; Case Code (Imperial): 0402; Case Code (Metric): 1005; Min Operating Temperature: -55°C; Max Operating Temperature: 155°C; Packaging: Tape and Reel; Tolerance: 1%; Termination: SMD/SMT; Voltage Rating (DC): 50V; Features: Moisture Resistant; Series: RC; Number of Terminations: 2; Construction: Rectangular; Length: 1mm; Depth: 0.5mm; Lead Free: Lead Free; RoHS Compliant: Yes; Military Standard: Not; ComponentLink1URL: https://datasheet.ciiva.com/5558/pyu-rc0402-51-rohs-l-6-r-5558205.pdf?src-supplier=Mouser; ComponentLink1Description: https://datasheet.ciiva.com/5558/pyu-rc0402-51-rohs-l-6-r-5558205.pdf?src-supplier=Mouser; ComponentLink2URL: https://datasheet.ciiva.com/16987/pyu-rc0402-51-rohs-l-6-r-16987189.pdf?src-supplier=Future+Electronics; ComponentLink2Description: https://datasheet.ciiva.com/16987/pyu-rc0402-51-rohs-l-6-r-16987189.pdf?src-supplier=Future+Electronics; LCSC PART Number: C185406
R38 R39 = RT0402DRE0782RL: RES SMD 82 OHM 0.5% 1/16W 0402; Manufacturer: Yageo; Max Power Dissipation: 63mW; Temperature Coefficient: 50ppm/°C; Voltage Rating (DC): 50V; Supplier: Digikey; Supplier Part Number: 311-82UTR-ND; Manufacturer Part Number: RT0402DRE0782RL; RoHS: Yes; Category: Chip SMD Resistors; Pricing: 10000=0.0203 (USD); Case/Package: 0402; Case Code (Metric): 1005; Case Code (Imperial): 0402; Min Operating Temperature: -55°C; Max Operating Temperature: 155°C; Package Quantity: 1; Value: 82R; Tolerance: 0.5%; Packaging: Cut Tape; Number of Terminations: 2; Features: Moisture Resistant; Series: RT; Length: 0.039inch; Width: 0.02inch; Height: 0.014inch; Lead Free: Lead Free; RoHS Compliant: Yes; ComponentLink1URL: https://www.yageo.com/upload/media/product/productsearch/datasheet/rchip/PYu-RT_1-to-0.01_RoHS_L_12.pdf?src-supplier=Digikey; ComponentLink1Description: https://www.yageo.com/upload/media/product/productsearch/datasheet/rchip/PYu-RT_1-to-0.01_RoHS_L_12.pdf?src-supplier=Digikey; ComponentLink2URL: http://www.yageo.com/documents/recent/PYu-RT_1-to-0.01_RoHS_L_8.pdf?src-supplier=Digikey; ComponentLink2Description: http://www.yageo.com/documents/recent/PYu-RT_1-to-0.01_RoHS_L_8.pdf?src-supplier=Digikey; LCSC PART Number: C854049
R40 = RC0402FR-7W100RL: RES 100 OHM 1% 1/8W 0402; Manufacturer: Yageo; Supplier: Digikey; Supplier Part Number: 13-RC0402FR-7W100RLCT-ND; Manufacturer Part Number: RC0402FR-7W100RL; RoHS: Yes; Category: Chip SMD Resistors; Stock: 5227; Pricing: 1=0.1, 10=0.013, 100=0.0071, 1000=0.00408, 2500=0.00306 (USD); Case/Package: 343Case; Packaging: 10Packaging; Value: 100R; RoHS Compliant: Yes; ComponentLink1URL: https://datasheet.octopart.com/RC0402FR-7W100RL-Yageo-datasheet-164759695.pdf?src-supplier=Future+Electronics; ComponentLink1Description: https://datasheet.octopart.com/RC0402FR-7W100RL-Yageo-datasheet-164759695.pdf?src-supplier=Future+Electronics; LCSC PART Number: C606168